# EAGLE design 213_lcd_mini (EAGLE 9.6.2)
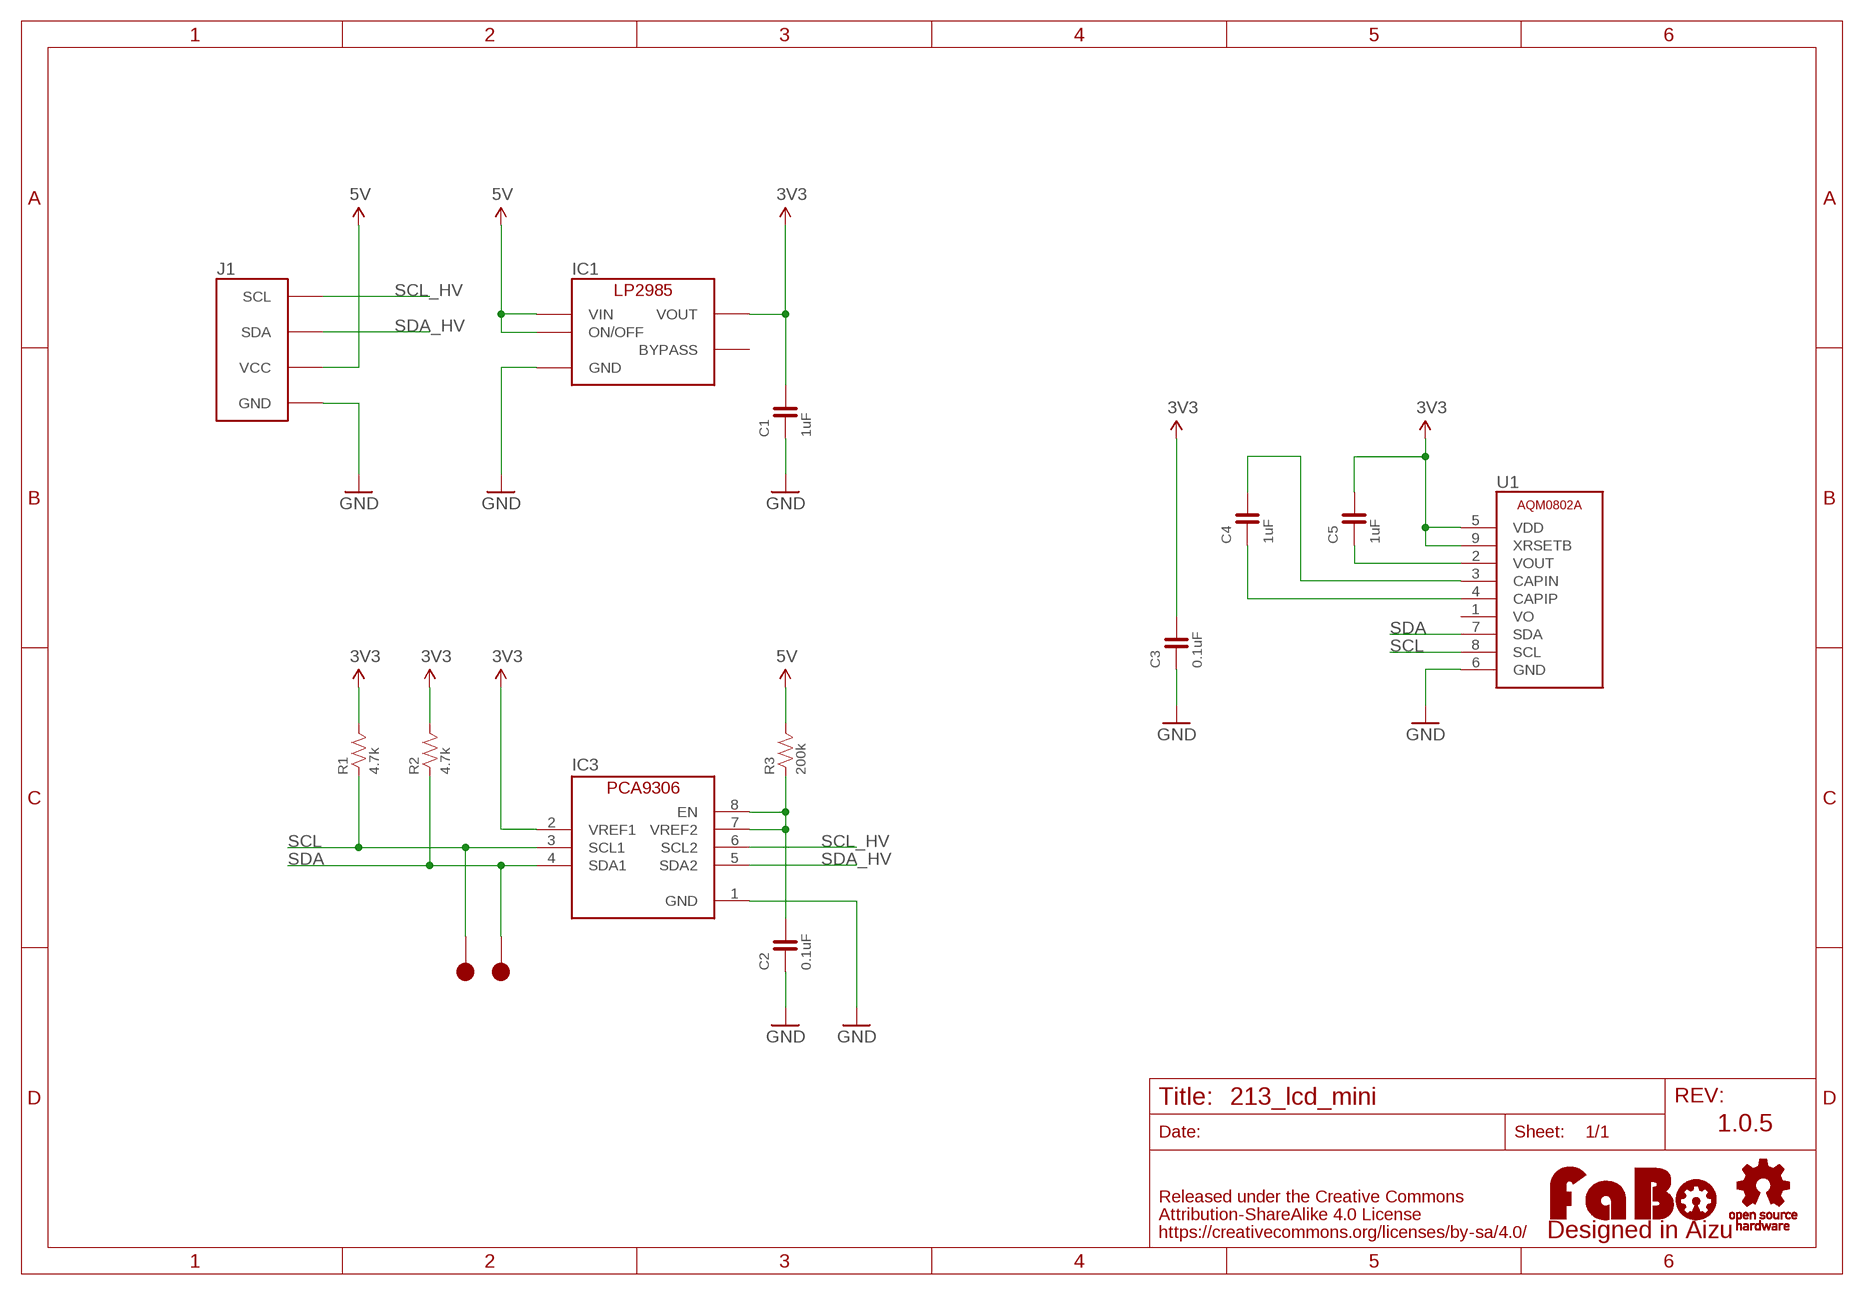
[diagram p0: schematic, sheet 1]

## Parts
C1  1uF  CAPACITOR-0603  [0603]
C2  0.1uF  CAPACITOR-0603  [0603]
C3  0.1uF  CAPACITOR-0603  [0603]
C4  1uF  CAPACITOR-0603  [0603]
C5  1uF  CAPACITOR-0603  [0603]
IC1  LP2985-33DBV  [SOT-23-5]
IC3  PCA9306GM  [XQFN8]
J1  FABO_BRICK_I2C  [FABO_BRICK_I2C]
LOGO1  LOGO_FABO-M  [LOGO_FABO_M]
R1  4.7k  RESISTOR-0603  [0603]
R2  4.7k  RESISTOR-0603  [0603]
R3  200k  RESISTOR-0603  [0603]
TP1  TP-15  [TP-15]
TP2  TP-15  [TP-15]
U1  AQM0802A  [AQM0802A]
U$2  LOGO_OSHW-M_BOTTOM  [LOGO_OSHW_M_BOTTOM]

## Nets
3V3: C1.2 C3.2 C5.2 IC1.5(VOUT) IC3.2(VREF1) R1.2 R2.2 U1.5(VDD) U1.9(XRSETB)
5V: IC1.1(VIN) IC1.3(ON/OFF) J1.VCC R3.2
CAPIN: C4.2 U1.3(CAPIN)
CAPIP: C4.1 U1.4(CAPIP)
GND: C1.1 C2.1 C3.1 IC1.2(GND) IC3.1(GND) J1.GND U1.6(GND)
N$1: C2.2 IC3.7(VREF2) IC3.8(EN) R3.1
SCL: IC3.3(SCL1) R1.1 TP2.1 U1.8(SCL)
SCL_HV: IC3.6(SCL2) J1.SCL
SDA: IC3.4(SDA1) R2.1 TP1.1 U1.7(SDA)
SDA_HV: IC3.5(SDA2) J1.SDA
VOUT: C5.1 U1.2(VOUT)
Unconnected: IC1.4(BYPASS) U1.1(VO)

## Notes on the sheet
- 1.0.5

## Library data of the parts
C1-C5 = FaBo-Capacitor:CAPACITOR: CAPACITOR
IC1 = FaBo-Supply:LP2985: LP2985
IC3 = FaBo-LevelTranslator:PCA9306
J1 = FaBo-Template:FABO_BRICK_I2C: FaBo Brick I2C
LOGO1 = component:LOGO_FABO
R1-R3 = FaBo-Resistors:RESISTOR: RESISTOR
TP1 TP2 = FaBo-Supply:TP
U1 = FaBo-Parts:AQM0802A: I2C LCD 8x2 I2C LCD 3.3V akizuki http://akizukidenshi.com/catalog/g/gP-06669/
U$2 = FaBo-etc:LOGO_OSHW

## Board
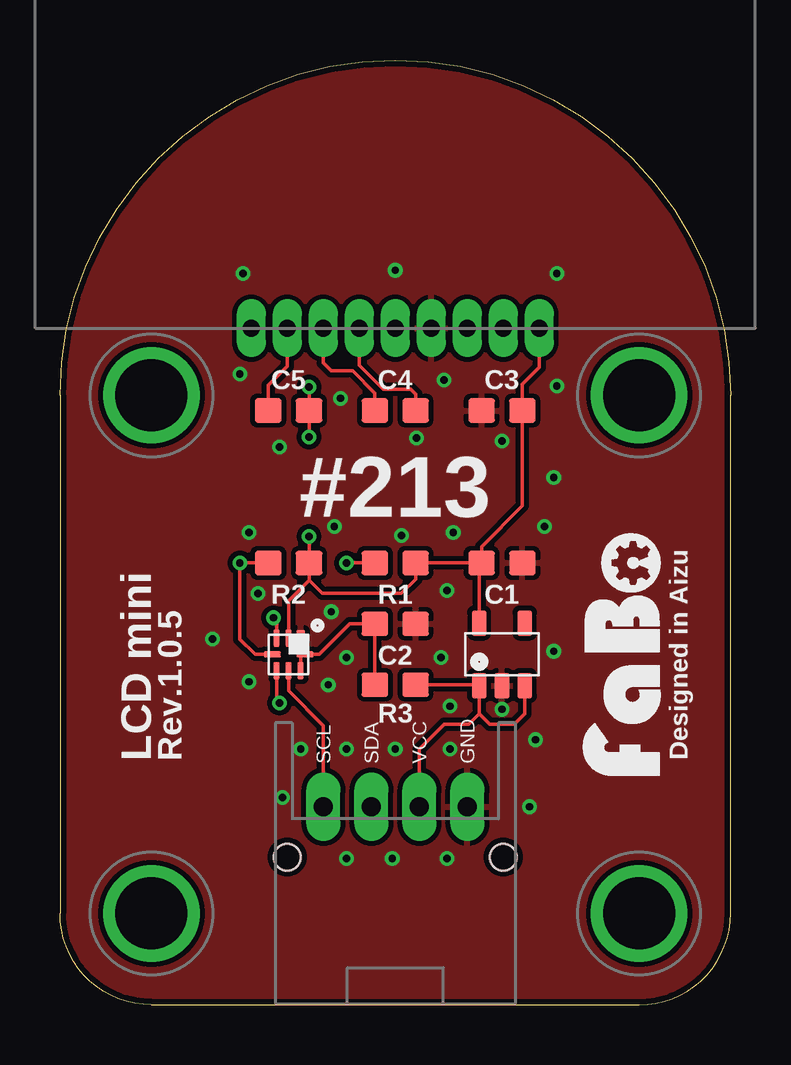
[diagram p1: board, top side]
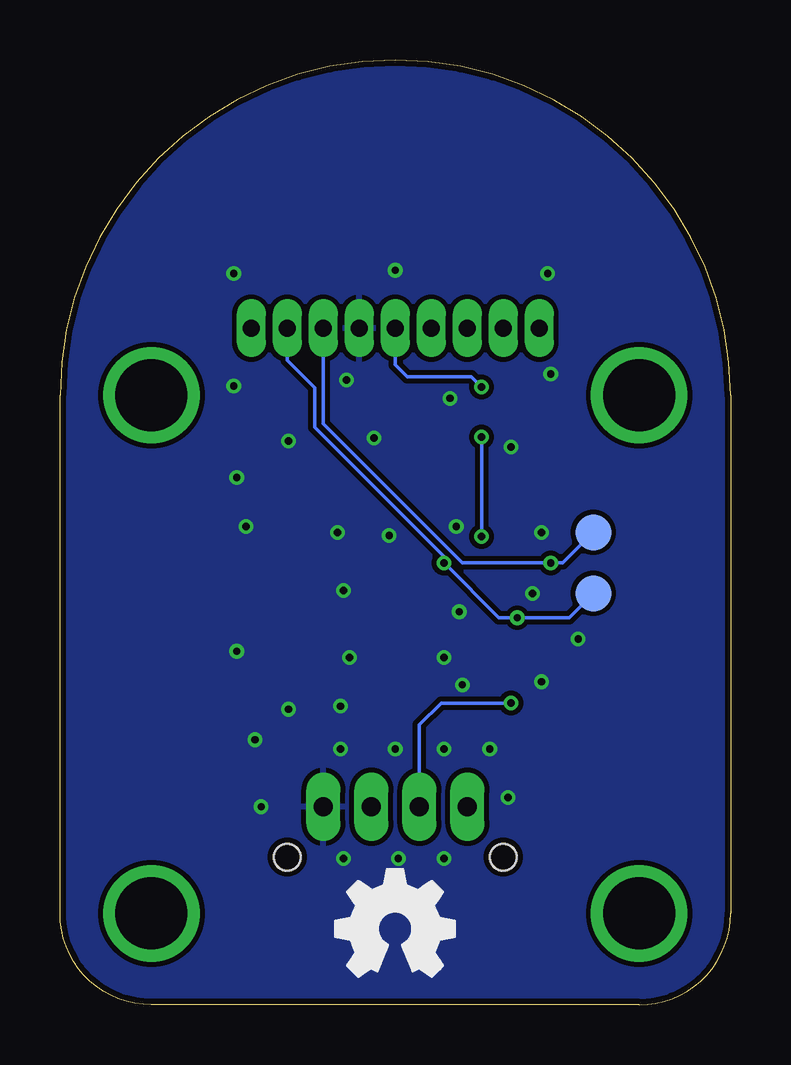
[diagram p2: board, bottom side, seen from below]

Size 27.94 x 39.37 mm. Coordinates in mm from the lower left corner, seen from the top.
Copper layers (1*16): Top 0.035mm / dielectric 1.6mm / Bottom 0.035mm
Design rules "PCBway": minimum track width 6mil, minimum drill 12mil, track to track 6mil, track to pad 6mil, pad to pad 6mil, via to via 6mil, smd to smd 6mil, copper to edge 10mil, drill to drill 10mil, minimum pad ring 10mil, minimum via ring 6mil, stop-mask expansion 2mil, vias tented up to drill 100mil, thermal gap 8mil

### Footprints (pad centres in the part's own frame; a part is rotated, then mirrored left to right if it is on the bottom)
0603 = smd 1.1 x 1: 1 -0.85,0; 2 0.85,0
SOT-23-5 = smd 0.6 x 1.05: 1 -0.95,-1.3; 2 0,-1.3; 3 0.95,-1.3; 4 0.95,1.3; 5 -0.95,1.3
XQFN8 = smd 0.7 x 0.35: 1 -0.675,0.5 | smd 0.7 x 0.25: 2 -0.675,0; 3 -0.675,-0.5; 5 0.675,-0.5; 6 0.675,0; 7 0.675,0.5 | smd 0.25 x 0.7: 4 0,-0.675; 8 0,0.675
FABO_BRICK_I2C = drill 0.8 pad 1.422 long: GND 3,-10.795; SCL -3,-10.795; SDA -1,-10.795; VCC 1,-10.795 | drill 3 pad 3.81: P$1 -10.16,6.35; P$2 10.16,6.35; P$3 -10.16,-15.24; P$4 10.16,-15.24 | hole 1.1: -4.5,-12.895; 4.5,-12.895
TP-15 = smd 1.5 x 1.5: 1 0,0
AQM0802A = drill 0.7 pad 1.143 long: 1 -6,0; 2 -4.5,0; 3 -3,0; 4 -1.5,0; 5 0,0; 6 1.5,0; 7 3,0; 8 4.5,0; 9 6,0

### Placement (x,y rotation side)
C1  18.41,18.41 180 top
C2  13.97,15.88 180 top
C3  18.41,24.77 0 top
C4  13.97,24.77 180 top
C5  9.53,24.77 0 top
IC1  18.41,14.61 0 top
IC3  9.53,14.61 270 top
J1  13.97,19.05 0 top
LOGO1  25.4,14.61 90 top
R1  13.97,18.41 0 top
R2  9.53,18.41 0 top
R3  13.97,13.34 0 top
TP1  5.71,19.68 0 bottom
TP2  5.71,17.14 0 bottom
U1  13.97,28.19 0 top
U$2  13.97,3.17 0 top

### Tracks (layer width: path | path; a pad name or v marks a point on that pad's centre or on a via)
3V3  (via drill 0.3)
  Top 0.152: IC1.5 17.46,18.32 C1.2 | C1.2 R1.2 14.82,17.74 14.22,17.14 10.92,17.14 10.38,17.69 | IC3.2 9.53,16.84 10.38,17.69 | C1.2 17.57,19.09 19.27,20.79 C3.2 19.27,25.87 19.97,26.57 U1.9 | v10.38,25.74 C5.2 v10.38,23.66 | 10.38,17.69 R2.2 v10.38,19.52
  Bottom 0.152: v10.38,25.74 10.79,26.16 13.46,26.16 13.97,26.67 U1.5 | v10.38,19.52 v10.38,23.66
5V
  Top 0.152: 17.46,12.13 IC1.1 17.43,13.34 R3.2 | 17.46,12.13 17.91,11.68 18.92,11.68 19.36,12.13 IC1.3 | J1.VCC 14.97,10.65 16,11.68 17.02,11.68 17.46,12.13
CAPIN
  Top 0.152: U1.3 10.97,26.75 11.3,26.42 12.19,26.42 13.12,25.49 C4.2
CAPIP
  Top 0.152: U1.4 12.47,26.65 13.46,25.65 14.61,25.65 14.82,25.44 C4.1
GND  (via drill 0.3)
  other vias: 20.7,25.78 16,26.04 11.68,25.27 7.49,26.29 7.62,30.48 13.97,30.61 20.7,30.48 20.57,21.97 18.41,23.5 14.86,23.62 9.14,23.24 20.19,19.94 16.38,19.68 11.43,19.94 7.87,19.68 8.26,17.14 11.3,16.38 16.13,17.27 14.22,19.56 11.94,14.48 15.88,14.48 16.26,12.45 11.94,10.67 10.03,10.67 7.87,13.46 6.35,15.24 13.97,10.67 16.26,10.67 19.81,11.05 20.57,14.73 18.41,12.32 11.94,6.1 13.84,6.1 16.13,6.1 19.56,8.26 9.27,8.64 11.18,13.34
  pour Bottom (isolate 0.203): 0,0 27.94,0 27.94,39.37 0,39.37
  pour Top (isolate 0.203): 0,0 27.94,0 27.94,39.37 0,39.37
N$1
  Top 0.152: R3.1 C2.2 12.06,15.88 10.79,14.61 IC3.8 10.03,14.61 IC3.7
SCL  (via drill 0.3)
  Top 0.152: R1.1 v11.94,18.41 | IC3.3 9.03,15.99 v8.89,16.13
  Bottom 0.152: U1.8 18.47,26.85 17.33,25.71 17.33,24.06 11.94,18.67 v11.94,18.41 9.65,16.13 v8.89,16.13 6.73,16.13 TP2.1
SCL_HV
  Top 0.152: IC3.6 9.53,13.08 10.97,11.64 J1.SCL
SDA  (via drill 0.3)
  Top 0.152: R2.1 v7.49,18.41 7.49,15.24 8.13,14.61 IC3.4
  Bottom 0.152: U1.7 16.97,24.21 11.18,18.41 v7.49,18.41 6.99,18.41 TP1.1
SDA_HV  (via drill 0.3)
  Top 0.152: IC3.5 9.03,12.69 v9.14,12.57
  Bottom 0.152: v9.14,12.57 12.06,12.57 12.97,11.67 J1.SDA
VOUT
  Top 0.152: U1.2 9.47,26.61 8.68,25.82 C5.1

### Text on the board
tPlace: #213 | Designed in Aizu | LCD mini | Rev.1.0.5